# EasyEDA Pro project G-CU_2023-09-08_13-42-00.eprj, schematic Schematic2
Create Date: 2024-02-06; Page Name: P1; Project Name: G-CU_2023-09-08_13-42-00; Schematic Name: Schematic2; Update Date: 2024-02-06; Company: 嘉立创EDA; Page Size: A4; Version: V1.0
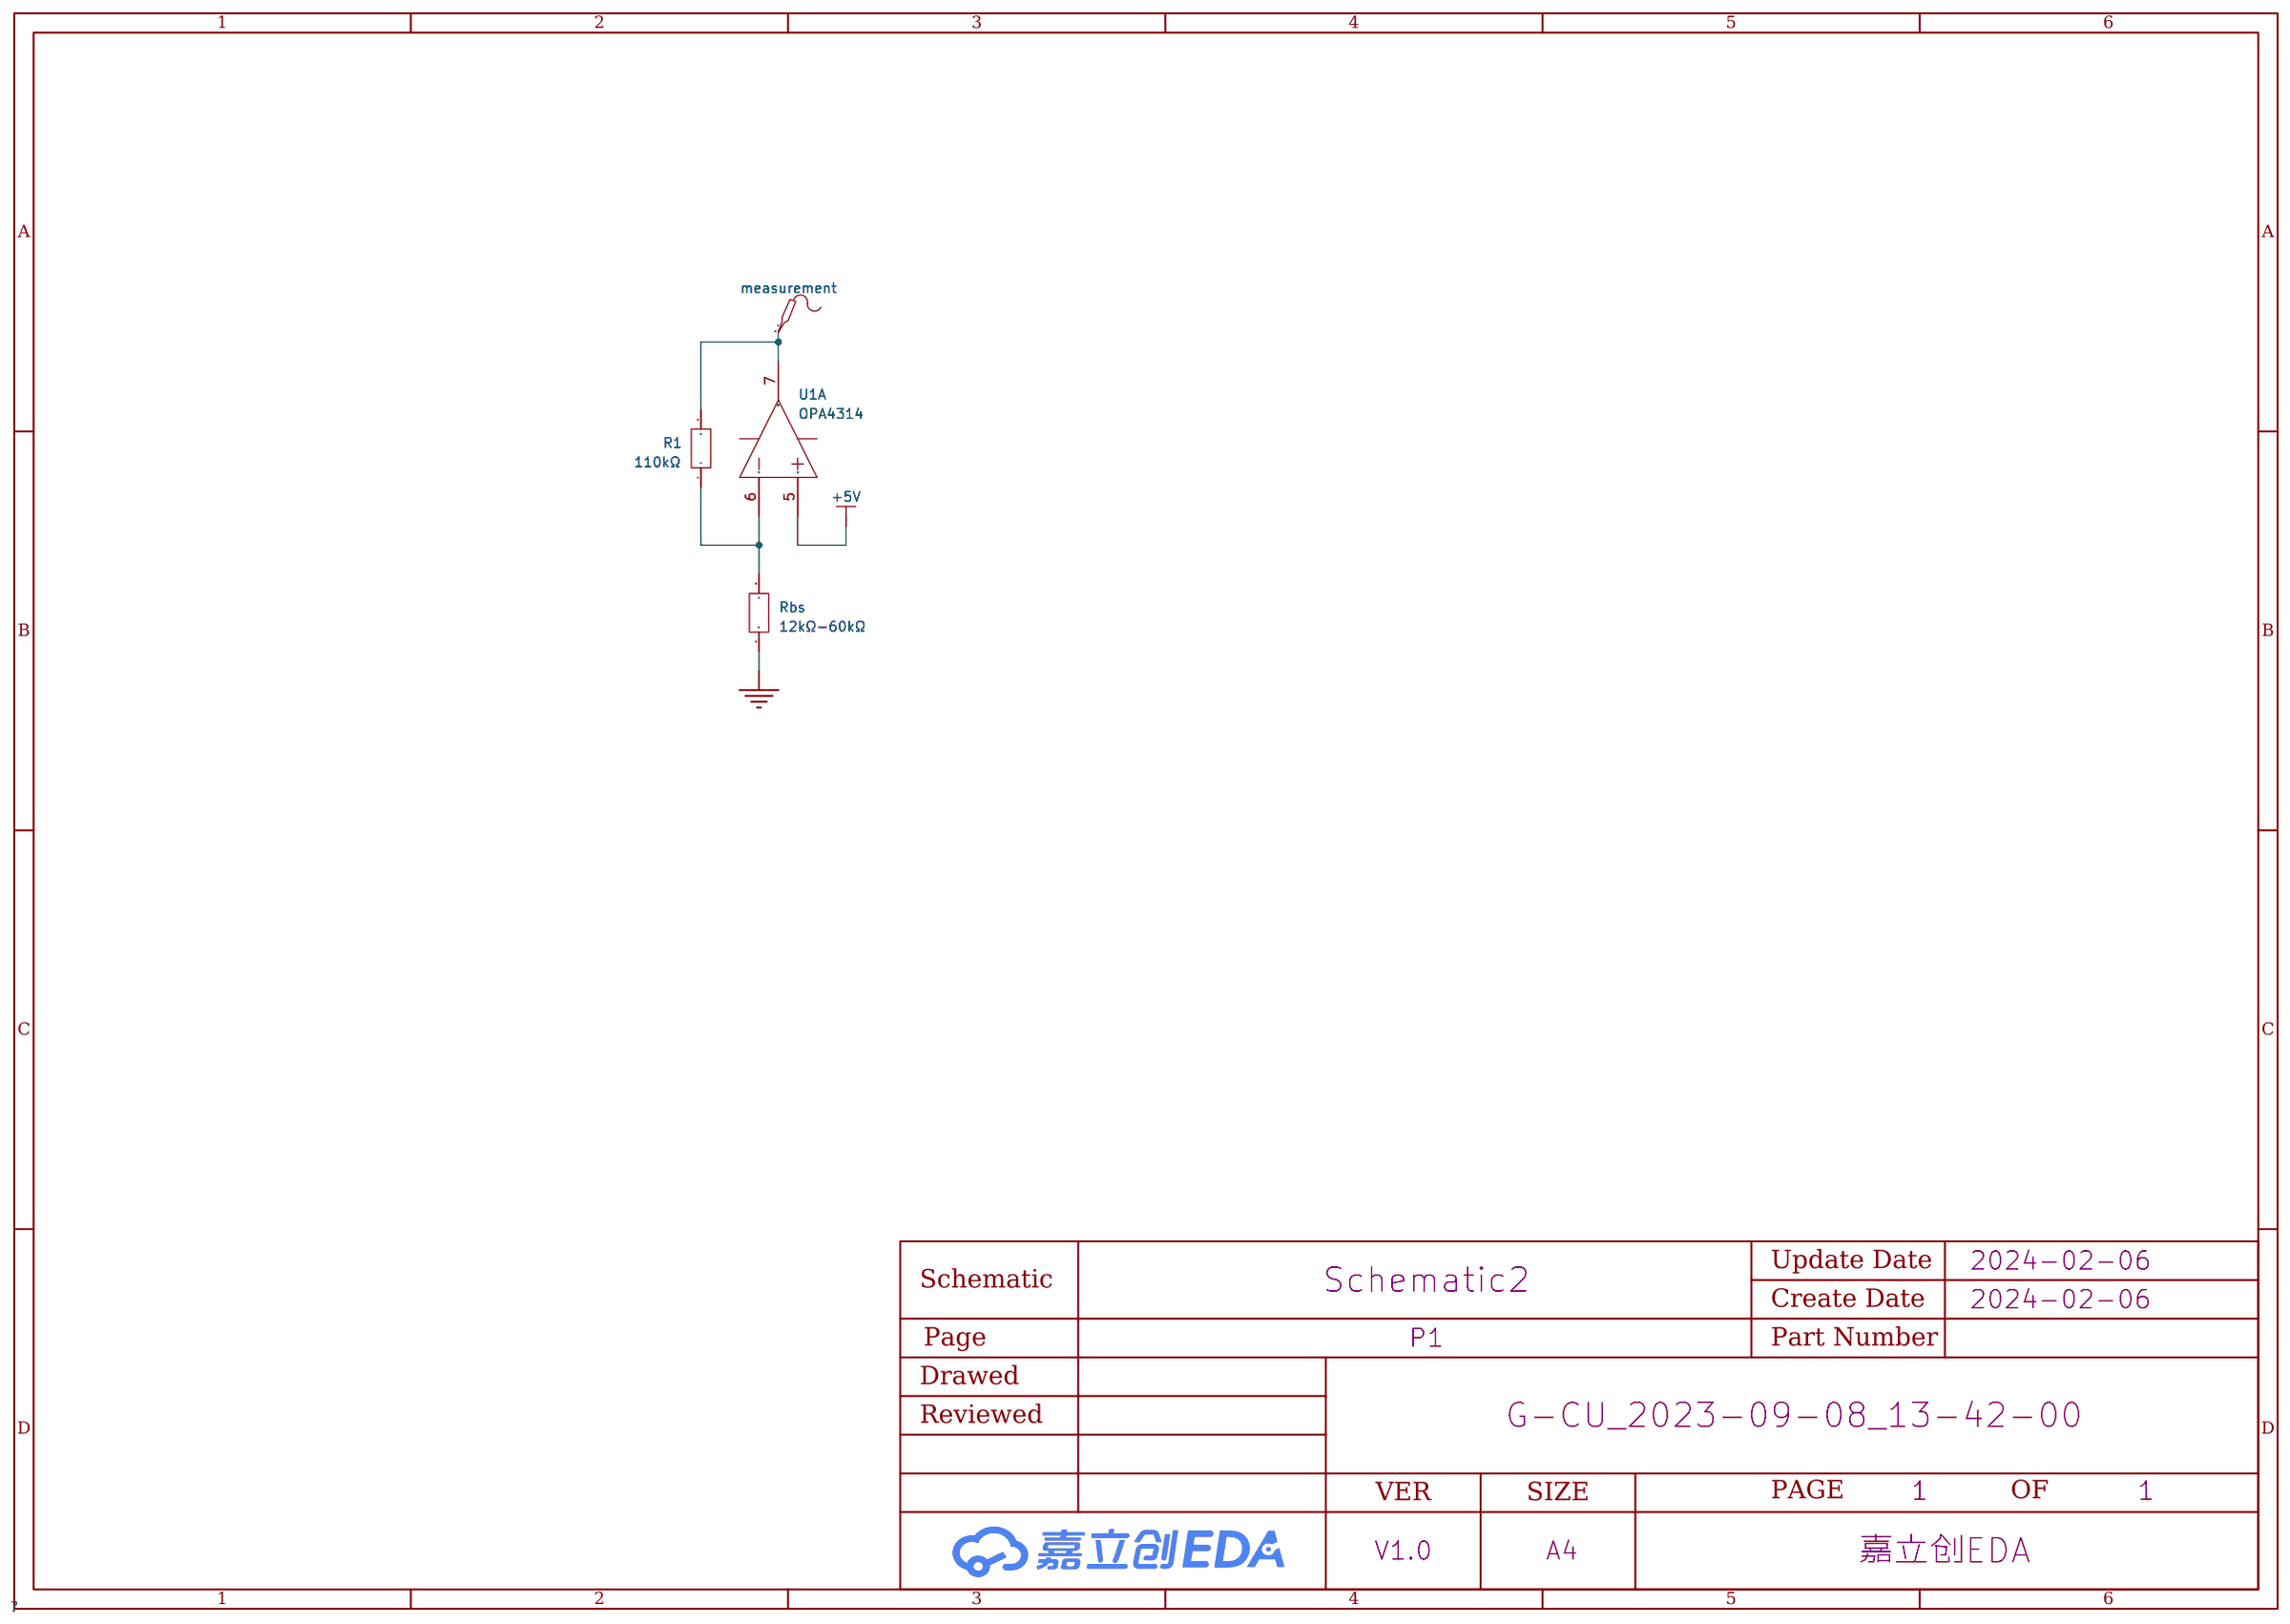
[diagram p1: schematic sheet]

## Parts
measurement  -  [Test-Point-0.5mm]
R1  110kΩ  [R0603]
Rbs  12kΩ-60kΩ  [R0603]
U1  OPA4314  [TSSOP-14_L5.0-W4.4-P0.65-LS6.4-BL]  (section 1)

## Library data of the parts
measurement = Test-Point: Test Point 测试点
R1 Rbs = AR03BTCX5001: 电阻类型:薄膜电阻;阻值:5kΩ;精度:±0.1%;功率:100mW;; LCSC Part Name: 5kΩ ±0.1% 100mW; Supplier Part: C2828621; Manufacturer: Viking(光颉); Supplier Footprint: 0603; JLCPCB Part Class: Extended Part; Datasheet: https://atta.szlcsc.com/upload/public/pdf/source/20211009/C2828621_7F88408CB1D09DFC08036051E0A6050B.pdf; Supplier: LCSC; Type: 薄膜电阻; Tolerance: ±0.1%; Power(Watts): 100mW; Temperature Coefficient: ±25ppm/℃; Overload Voltage (Max): 50V; Operating Temperature Range: -55℃~+155℃
U1 = OPA4314AIPWR: OPA4314 四路、3MHz、低功耗、低噪声、RRI/O、1.8V CMOS 运算放大器; Supplier Part: C129333; Manufacturer: TI(德州仪器); Supplier Footprint: TSSOP-14; JLCPCB Part Class: Extended Part; Datasheet: https://atta.szlcsc.com/upload/public/pdf/source/20170914/C129333_1505359967979968173.pdf; Supplier: LCSC

## Nets
+5V: U1.5(IN B+)
GND: Rbs.1
Net-(measurement-1): measurement.1 R1.2 U1.7(OUT B)
Net-(R1-1): R1.1 Rbs.2 U1.6(IN B-)
